# Altium schematic sheet SmartCard.SchDoc: Smart Card
size A4; Date: Not used; ApprovedBy: Not used; CheckedBy: Not used; Author: Not used; CompanyName: STMicroelectronics; DrawnBy: Not used; Engineer: Not used; Organization: Not used; Address1: Not used; Address2: Not used; Address3: Not used; Address4: Not used; DocumentNumber: Not used; Revision: Not used; SheetNumber: 15; SheetTotal: 22; CurrentTime: Not used; CurrentDate: Not used; Time: Not used; DocumentFullPathAndName: Not used; DocumentName: Not used; ModifiedDate: Not used; ImagePath: Not used; ProjectName: Not used; Application_BuildNumber: Not used
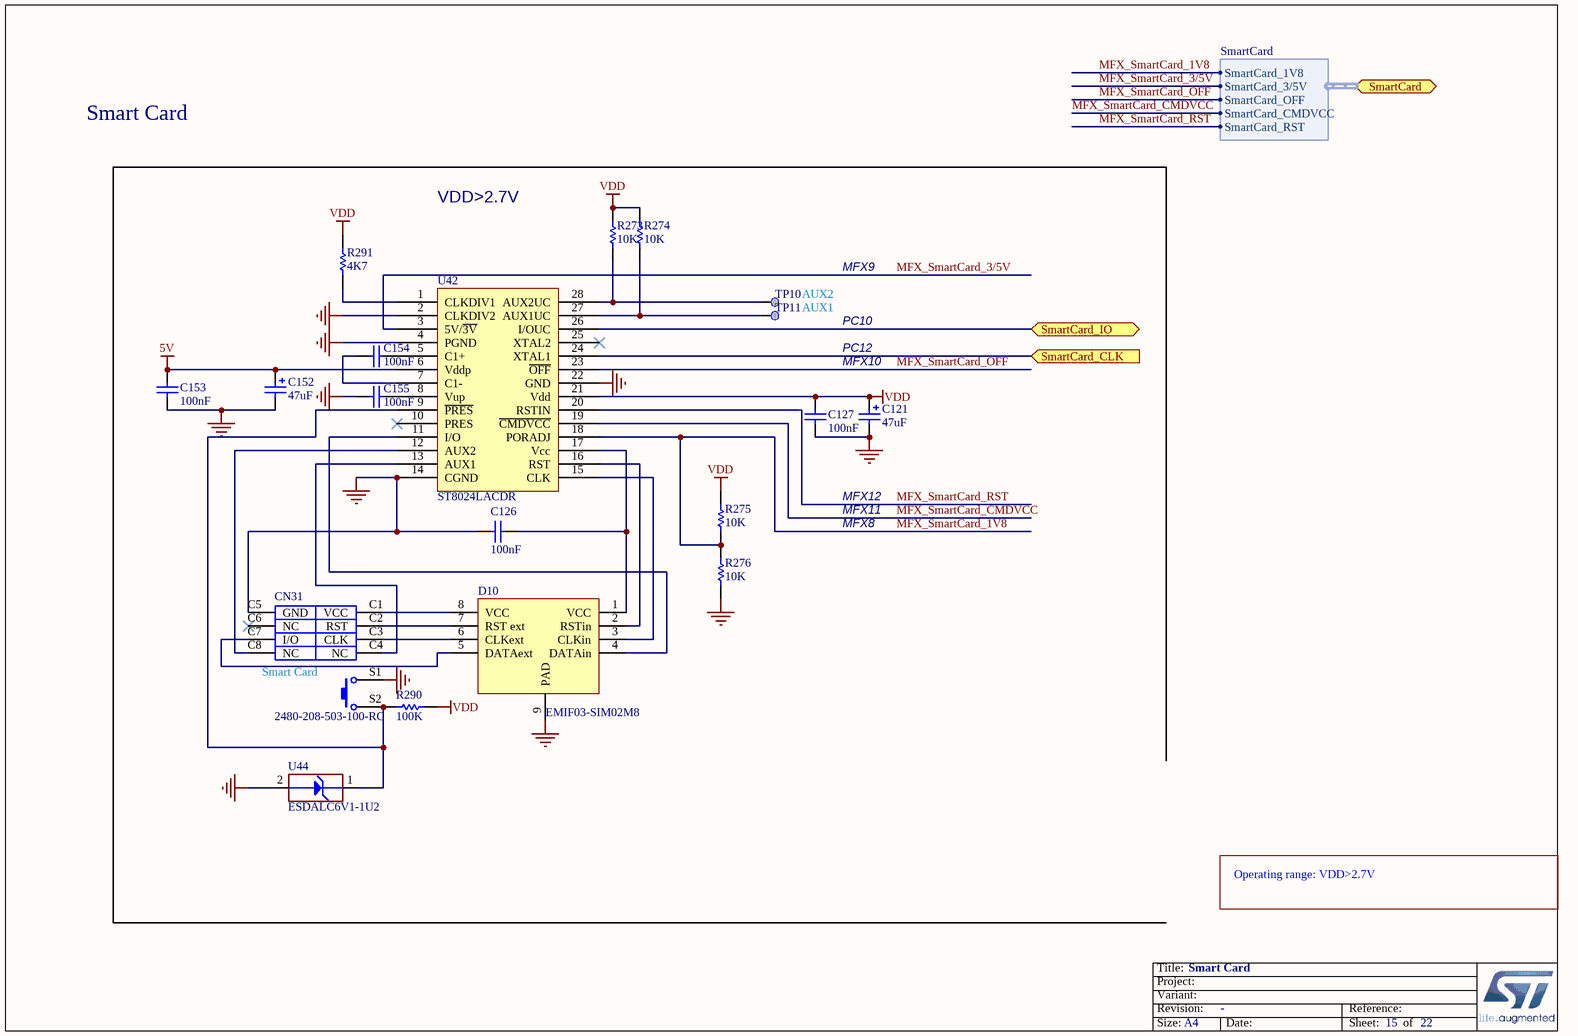
[diagram p0: SmartCard.SchDoc]

## Parts
C121  value 47uF  [CPOL_TAJ-C_2312_H2P6]  (hidden comment: Cap_POL_TANA)
C126  value 100nF  [C0603]  (hidden comment: Capacitor)
C127  value 100nF  [C0603]  (hidden comment: Capacitor)
C152  value 47uF  [CPOL_TAJ-C_2312_H2P6]  (hidden comment: Cap_POL_TANA)
C153  value 100nF  [C0603]  (hidden comment: Capacitor)
C154  value 100nF  [C0603]  (hidden comment: Capacitor)
C155  value 100nF  [C0603]  (hidden comment: Capacitor)
CN31  value 2480-208-503-100-RC  [CON_CARD-SOCKET_GUANG-LIAN-WEI_2480-208-503-100-RC]  (hidden comment: Please to check it carefuly. Pin 8 and 9 not clearly define on datasheet. Need to validate with schematics symbol)
D10  EMIF03-SIM02M8  [ESD_UQFN8-EPAD_1P7X1P5_P040]
R273  value 10K  [R0603]  (hidden comment: Resistor)
R274  value 10K  [R0603]  (hidden comment: Resistor)
R275  value 10K  [R0603]  (hidden comment: Resistor)
R276  value 10K  [R0603]  (hidden comment: Resistor)
R290  value 100K  [R0603]  (hidden comment: Resistor)
R291  value 4K7  [R0402]  (hidden comment: Resistor)
TP10  Test Point  [TP_SMD_1MM]  (value not drawn)  (no BOM)
TP11  Test Point  [TP_SMD_1MM]  (value not drawn)  (no BOM)
U42  value ST8024LACDR  [ICC_SO28_18P10X7P60_P127]  (hidden comment: ST8024CTR)
U44  value ESDALC6V1-1U2  [ESD_ST0201]  (hidden comment: ESD-TRANSIL)

## Ports
SmartCard (harness SmartCard), SmartCard_CLK (in), SmartCard_IO (bidir)

## Harnesses
SmartCard: SmartCard_1V8, SmartCard_3/5V, SmartCard_OFF, SmartCard_CMDVCC, SmartCard_RST

## Nets
5V: C152.1 C153.2 U42.6(Vddp)
GND: C121.2 C126.2 C127.1 C152.2 C153.1 C155.2 CN31.C5(GND) CN31.S1 D10.9(PAD) R276.1 U42.2(CLKDIV2) U42.4(PGND) U42.14(CGND) U42.22(GND) U44.2(GND)
VDD: C121.1 C127.2 R273.2 R274.2 R275.2 R290.2 R291.2 U42.21(Vdd)
MFX_SmartCard_1V8: R275.1 R276.2 U42.18(PORADJ) ; port SmartCard.SmartCard_1V8
MFX_SmartCard_3/5V: U42.3(5V/~{3V}) ; port SmartCard.SmartCard_3/5V
MFX_SmartCard_CMDVCC: U42.19(~{CMDVCC}) ; port SmartCard.SmartCard_CMDVCC
MFX_SmartCard_OFF: U42.23(~{OFF}) ; port SmartCard.SmartCard_OFF
MFX_SmartCard_RST: U42.20(RSTIN) ; port SmartCard.SmartCard_RST
SmartCard_CLK: U42.24(XTAL1) ; port SmartCard_CLK
SmartCard_IO: U42.26(I/OUC) ; port SmartCard_IO
NetC126_1: C126.1 D10.1(VCC) U42.17(Vcc)
NetC154_1: C154.1 U42.5(C1+)
NetC154_2: C154.2 U42.7(C1-)
NetC155_1: C155.1 U42.8(Vup)
NetCN31_C1: CN31.C1(VCC) D10.8(VCC)
NetCN31_C2: CN31.C2(RST) D10.7(RST_ext)
NetCN31_C3: CN31.C3(CLK) D10.6(CLKext)
NetCN31_C4: CN31.C4(NC) U42.13(AUX1)
NetCN31_C7: CN31.C7(I/O) D10.5(DATAext)
NetCN31_C8: CN31.C8(NC) U42.12(AUX2)
NetCN31_S2: CN31.S2 R290.1 U42.9(~{PRES}) U44.1(IO1)
NetD10_2: D10.2(RSTin) U42.16(RST)
NetD10_3: D10.3(CLKin) U42.15(CLK)
NetD10_4: D10.4(DATAin) U42.11(I/O)
NetR273_1: R273.1 TP10.1 U42.28(AUX2UC)
NetR274_1: R274.1 TP11.1 U42.27(AUX1UC)
NetR291_1: R291.1 U42.1(CLKDIV1)

Not connected (* = marked no-connect by the designer): CN31 C6(NC)*; U42 10(PRES)* 25(XTAL2)*

## Notes on the sheet
- Smart Card
- VDD>2.7V
- AUX2
- AUX1
- MFX9
- MFX10
- PC12
- PC10
- MFX12
- MFX11
- MFX8
- (near CN31) Smart Card
- Operating range: VDD>2.7V
- Title:
- Project:
- Size:
- Revision:
- Variant:
- A4
- -
- Date:
- Reference:
- Sheet:
- of

## Library data of the parts
C121 C152 = MCD-00559: Capacitor, Tantalum, 47uF, 16V, 10%, TypeC; Manufacturer_Part_Number: TAJC476K016RNJ; Manufacturer: AVX; Provided_By: SUBCO; Initial_Board_Reference: MB1331; Path: ws/MCD_ApplicationBoards/Lists/MCDPARTSdatabase; Item Type: Item; Revision: July-2002: Re-released for DXP Platform.; Internal_Part_Number: MCD-00559; Status: Footprint available; Part_Type: Capacitor; Package: C2312; ComponentLink1Description: Datasheet; ComponentLink1URL: http://tunmcdsvn.tun.st.com/Component_Datasheet_Library/Trunk/Capacitors/AVX_Capacitor_TAJ-series
C126 C127 C153-C155 = MCD-00211: Capacitor, MLCC, 100nF, 16V, X7R, 10%, 0603, T=0,8mm; Manufacturer_Part_Number: CC0603KRX7R7BB104; Manufacturer: YAGEO; Provided_By: SUBCO; Initial_Board_Reference: MB1319; Path: ws/MCD_ApplicationBoards/Lists/MCDPARTSdatabase; Item Type: Item; Internal_Part_Number: MCD-00211; Status: Released; Part_Type: Capacitor; Package: C0603; ComponentLink1Description: Datasheet; ComponentLink1URL: http://tunmcdsvn.tun.st.com/Component_Datasheet_Library/Trunk/Capacitors/Yageo_Multilayer_Capacitor_X7R_series_100pF_to_22uF
CN31 = Smart_card_2480-208-503-100-RC: IC Card Socket 8 pin, SMT Open for Smartcard; Internal_Part_Number: MCD-01175; Part_Type: Connector; Manufacturer: GUANG LIAN WEI; Provided_By: Subcon; Initial_Board_Reference: MB1397; Status: Footprint available; Manufacturer_Part_Number: 2480-208-503-100-RC; ComponentLink1Description: GUANG_LIAN_WEI_2480-208-503-100-RC.pdf; ComponentLink1URL: http://tunmcdsvn.tun.st.com/Component_Datasheet_Library/Trunk/Connectors/GUANG_LIAN_WEI_2480-208-503-100-RC; ECCN_US: n/a; ECCN_EU: n/a
D10 = MCD-01229: 3 line IPAD, EMI filter for SIM card applications; Part_Type: Diode; Manufacturer: STMICROELECTRONICS; BMS_Part_Number: 9179047; Provided_By: SUBCO with ST control; Initial_Board_Reference: MB1397; Path: ws/MCD_ApplicationBoards/Lists/MCDPARTSdatabase; Item Type: Item; Internal_Part_Number: MCD-01229; Value: EMIF03-SIM02M8; Status: Released; Manufacturer_Part_Number: EMIF03-SIM02M8; ComponentLink1Description: Datasheet; ComponentLink1URL: http://tunmcdsvn.tun.st.com/Component_Datasheet_Library/Trunk/Diodes/STM_ESD_EMIF03-SIM02M8
R273-R276 = MCD-00220: Resistor,10K,0603,1%,1/10W; Manufacturer_Part_Number: RC0603FR-0710KL; Manufacturer: YAGEO; Provided_By: SUBCO; Initial_Board_Reference: MB1319; Path: ws/MCD_ApplicationBoards/Lists/MCDPARTSdatabase; Item Type: Item; Internal_Part_Number: MCD-00220; Status: Released; Part_Type: Resistor; Package: R0603; ComponentLink1Description: Datasheet; ComponentLink1URL: http://tunmcdsvn.tun.st.com/Component_Datasheet_Library/Trunk/Resistors/Yageo_Resistor_RC0603-series
R290 = MCD-00223: Resistor,100K,0603,1%,1/10W; Manufacturer_Part_Number: RC0603FR-07100KL; Manufacturer: YAGEO; Provided_By: SUBCO; Initial_Board_Reference: MB1319; Path: ws/MCD_ApplicationBoards/Lists/MCDPARTSdatabase; Item Type: Item; Internal_Part_Number: MCD-00223; Status: Released; Part_Type: Resistor; Package: R0603; ComponentLink1Description: Datasheet; ComponentLink1URL: http://tunmcdsvn.tun.st.com/Component_Datasheet_Library/Trunk/Resistors/Yageo_Resistor_RC0603-series
R291 = MCD-00065: Resistor,4K7,0402,1%,1/16W; Manufacturer_Part_Number: RC0402FR-074K7L; Manufacturer: YAGEO; Alternate_Manufacturer_Part_Number: RT0402FRE074K7L; Provided_By: SUBCO; Initial_Board_Reference: MB1274; Path: ws/MCD_ApplicationBoards/Lists/MCDPARTSdatabase; Item Type: Item; Internal_Part_Number: MCD-00065; Status: Released; Part_Type: Resistor; Package: R0402; ComponentLink1Description: Datasheet; ComponentLink1URL: http://tunmcdsvn.tun.st.com/Component_Datasheet_Library/Trunk/Resistors/Yageo_Resistor_RC0402-series; Alternate_Manufacturer: YAGEO
TP10 TP11 = MCD-00074: Test Point 1mm; Part_Type: Mechanical; Initial_Board_Reference: MB1274; Path: ws/MCD_ApplicationBoards/Lists/MCDPARTSdatabase; Item Type: Item; Internal_Part_Number: MCD-00074; Provided_By: n/a; Status: Released; ComponentLink1Description: Datasheet; ComponentLink1URL: http://na; Manufacturer: n/a; Manufacturer_Part_Number: n/a
U42 = MCD-01162: Smartcard interfaces; Part_Type: IC; Manufacturer: STMICROELECTRONICS; BMS_Part_Number: 9177831; Provided_By: SUBCO with ST control; Initial_Board_Reference: MB1397; Remark: idem ST8024CTR; Path: ws/MCD_ApplicationBoards/Lists/MCDPARTSdatabase; Item Type: Item; Internal_Part_Number: MCD-01162; Status: Released; Manufacturer_Part_Number: ST8024LACDR; ComponentLink1Description: Datasheet; ComponentLink1URL: http://tunmcdsvn.tun.st.com/Component_Datasheet_Library/Trunk/IC/STM_Smartcard interface_ST8024L
U44 = MCD-00170: ESD protection 6V1; Part_Type: Diode; Manufacturer: STMICROELECTRONICS; BMS_Part_Number: 9151132; Provided_By: SUBCO with ST control; Initial_Board_Reference: MB1274; Path: ws/MCD_ApplicationBoards/Lists/MCDPARTSdatabase; Item Type: Item; Internal_Part_Number: MCD-00170; Status: Released; Manufacturer_Part_Number: ESDALC6V1-1U2; ComponentLink1Description: Datasheet; ComponentLink1URL: http://tunmcdsvn.tun.st.com/Component_Datasheet_Library/Trunk/Diodes/STM_ESD_ESDALC6V1-1U2